# EAGLE schematic ServoController (EAGLE 8.3.1)
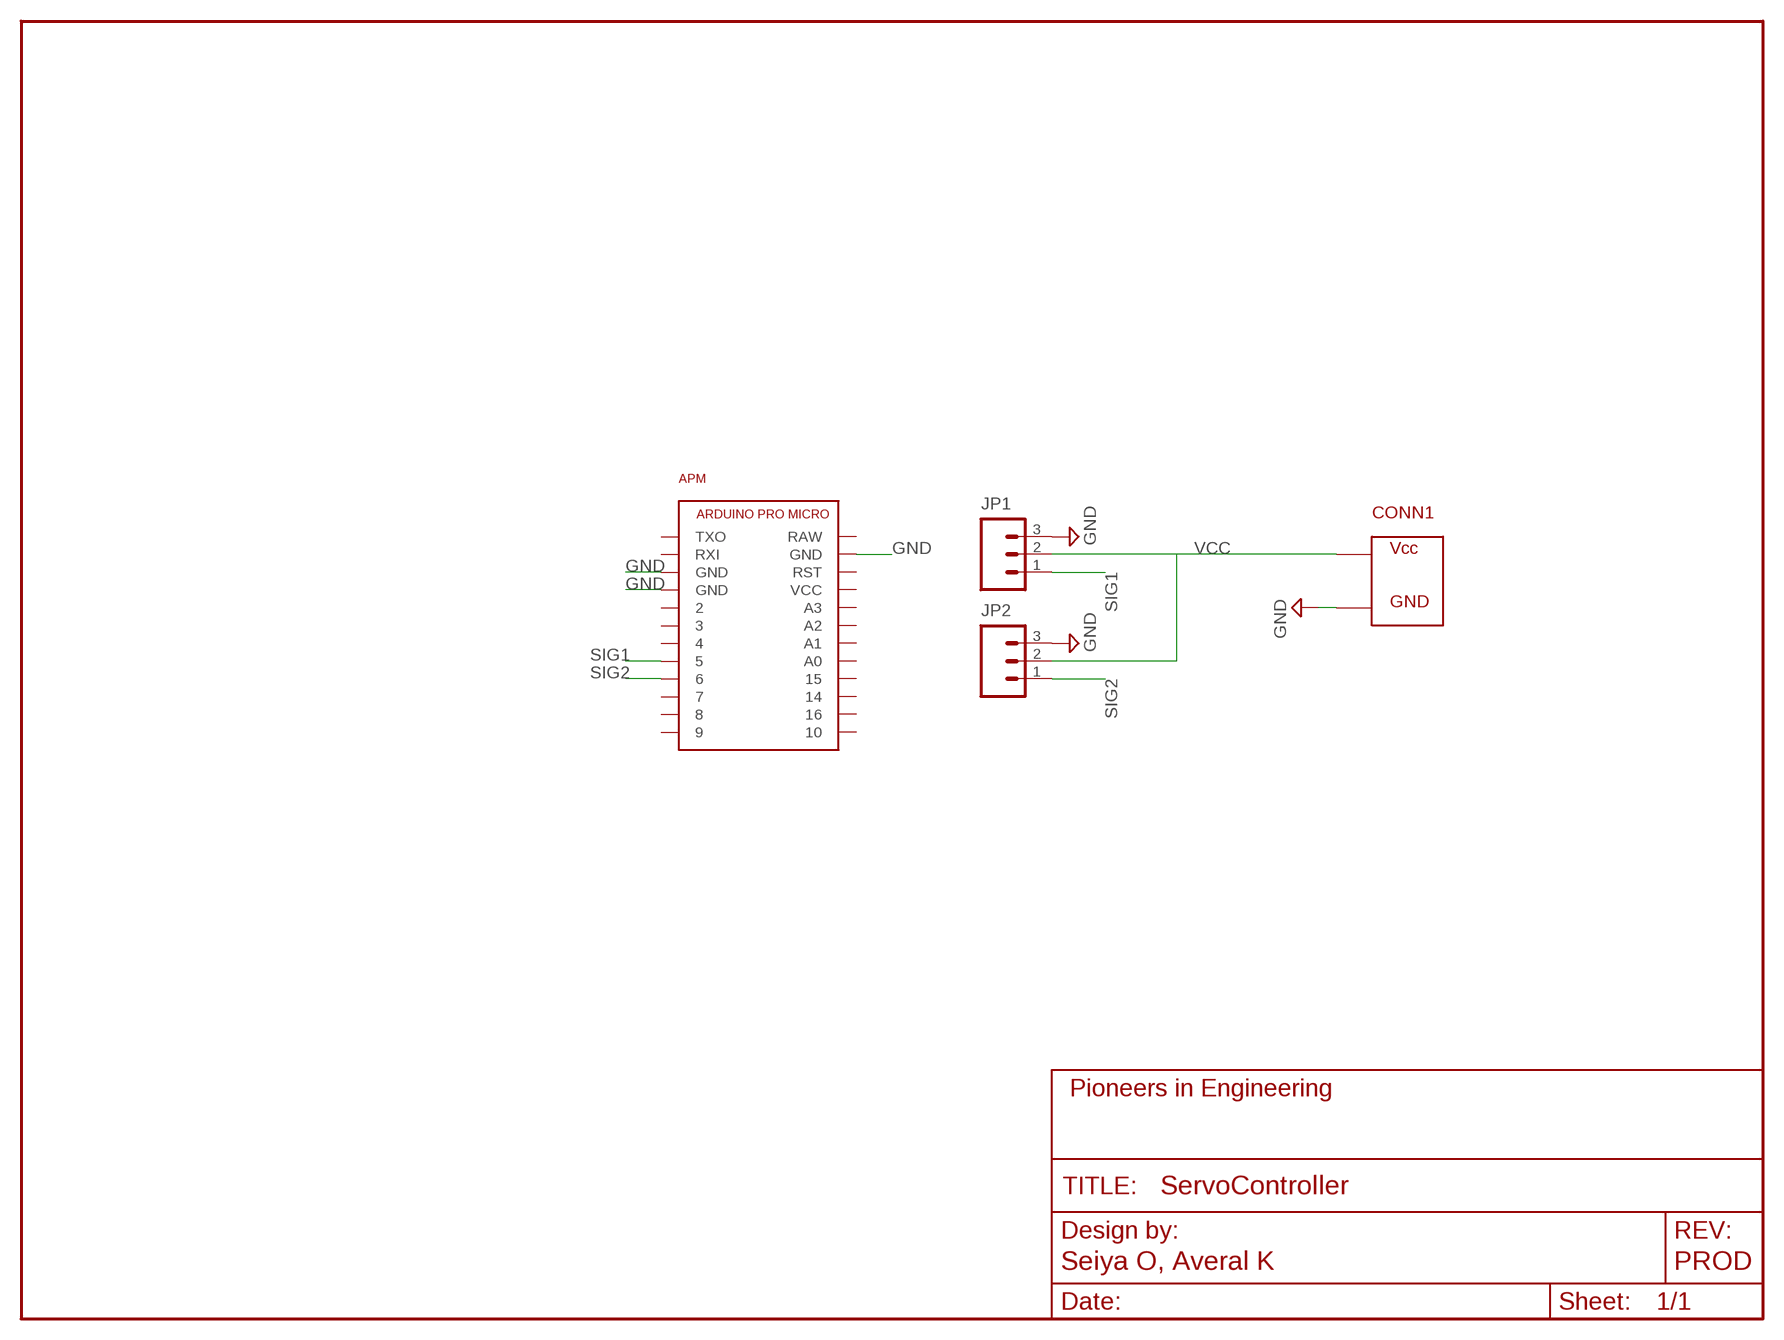
[diagram p0: schematic, sheet 1]
FRAME1 (FRAME_SCHEMATIC): AUTHOR: Seiya O, Averal K; REVISION: PROD

## Parts
APM  ARDUINO_PRO_MICRO  [ARDUINO_PRO_MICRO]
CONN1  ATX  [ATX]
JP1  M031X03-MTA  [1X03-MTA]
JP2  M031X03-MTA  [1X03-MTA]

## Nets
GND: APM.GND@0(GND) APM.GND@1(GND) APM.GND@2(GND) CONN1.P$2 JP1.3 JP2.3
SIG1: APM.5 JP1.1
SIG2: APM.6 JP2.1
VCC: CONN1.P$1 JP1.2 JP2.2
Unconnected: APM.2 APM.3 APM.4 APM.7 APM.8 APM.9 APM.10 APM.14 APM.15 APM.16 APM.A0 APM.A1 APM.A2 APM.A3 APM.RAW APM.RST APM.RXI APM.TXO APM.VCC

## Library data of the parts
APM = pie:ARDUINO_PRO_MICRO: Arduino Pro Micro Electrical System Year 9's Smart Sensor Core Pin Outs <https://cdn.sparkfun.com/assets/9/c/3/c/4/523a1765757b7f5c6e8b4567.png> Buy Here <http://www.aliexpress.com/item/Mini-Leonardo-Pro-Micro-ATmega32U4-5V-16MHz-Module-For-Arduino-Best-Quality/32284746884.html?ws_ab_test=searchweb201556_8,searchweb201602_2_10057_10056_10065_10055_10054_10067_10069_10059_10058_10017_10070_10060_10061_10052_10062_10053_10050_10051,searchweb201603_1&btsid=45993952-29ca-4de4-a0fb-c7fb72b8e1a5> Thru Hole Female Pins <http://www.digikey.com/product-search/en?keywords=929974E-01-12-ND> Surface Mount Female Pins <http://www.digikey.com/product-detail/en/sullins-connector-solutions/NPTC121KFXC-RC/S5604-ND/776062>; DESCRIPTION: Arduino Pro Micro; DISTRIBUTOR: AliExpress; DISTRIBUTOR_PART_NUMBER: 32284746884; MANUFACTURER: Feiyang electronics; NOTES: https://www.aliexpress.com/item/Mini-Leonardo-Pro-Micro-ATmega32U4-5V-16MHz-Module-For-Arduino-Best-Quality/32284746884.html?ws_ab_test=searchweb201556_8,searchweb201602_2_10057_10056_10065_10055_10054_10067_10069_10059_10058_10017_10070_10060_10061_10052_10062_10053_10050_10051,searchweb201603_1&btsid=45993952-29ca-4de4-a0fb-c7fb72b8e1a5; PACKAGE: ARDUINO_PRO_MICRO; REFERENCE_DEST: ARDUINO_PRO_MICRO
CONN1 = pie:ATX: ATX 2 Pin Connector Crimper: http://www.digikey.com/product-detail/en/molex-llc/0640160204/WM17553-ND/2074099 Housing: http://www.digikey.com/product-detail/en/molex-llc/0019092029/WM4382-ND/2421313 Housing (alternative): http://www.digikey.com/product-detail/en/molex-llc/0015311026/WM1041-ND/313614 Connector: http://www.digikey.com/product-detail/en/molex-llc/0019091029/WM1602-ND/26354 Male crimps: http://www.digikey.com/product-detail/en/molex-llc/0002092103/WM1100-ND/26384 Female crimps: http://www.digikey.com/product-detail/en/molex-llc/0002091104/WM1101-ND/26386
JP1 JP2 = pie:M03: 3-pin 0.1-inch header and MTA connector; PIE-INT-REF-NUM: MTA